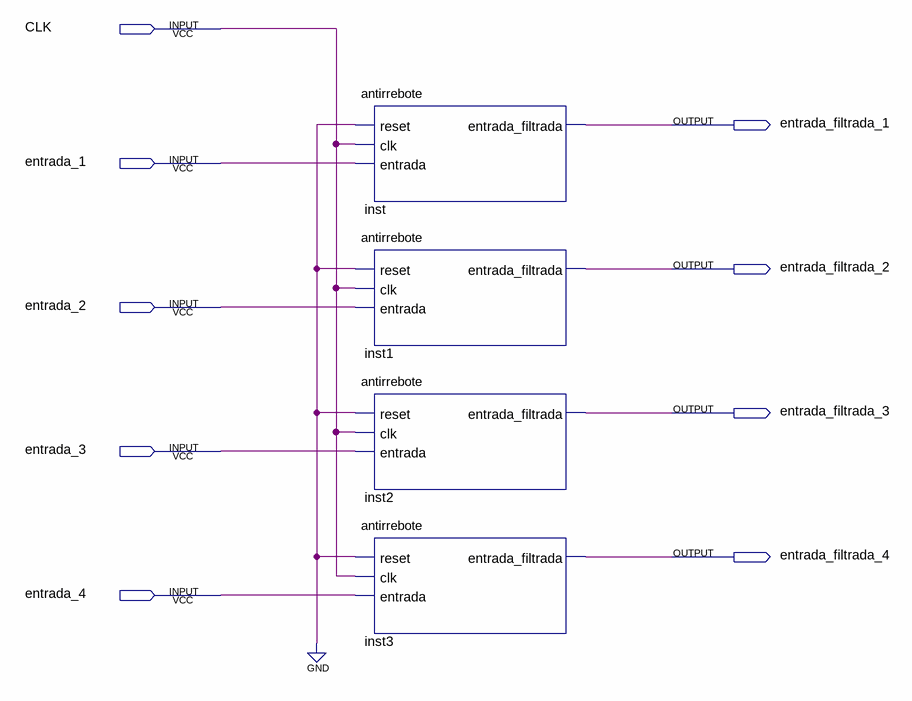
[diagram p0: schematic sheet]
// Quartus schematic antirrebote_4_entradas.bdf as structural Verilog: 4 symbols, 9 pins
module antirrebote_4_entradas (
  input  CLK,
  input  entrada_1,
  input  entrada_2,
  input  entrada_3,
  input  entrada_4,
  output entrada_filtrada_1,
  output entrada_filtrada_2,
  output entrada_filtrada_3,
  output entrada_filtrada_4
);

  antirrebote inst (.reset(1'b0), .clk(CLK), .entrada(entrada_1), .entrada_filtrada(entrada_filtrada_1));
  antirrebote inst1 (.reset(1'b0), .clk(CLK), .entrada(entrada_2), .entrada_filtrada(entrada_filtrada_2));
  antirrebote inst2 (.reset(1'b0), .clk(CLK), .entrada(entrada_3), .entrada_filtrada(entrada_filtrada_3));
  antirrebote inst3 (.reset(1'b0), .clk(CLK), .entrada(entrada_4), .entrada_filtrada(entrada_filtrada_4));
endmodule
